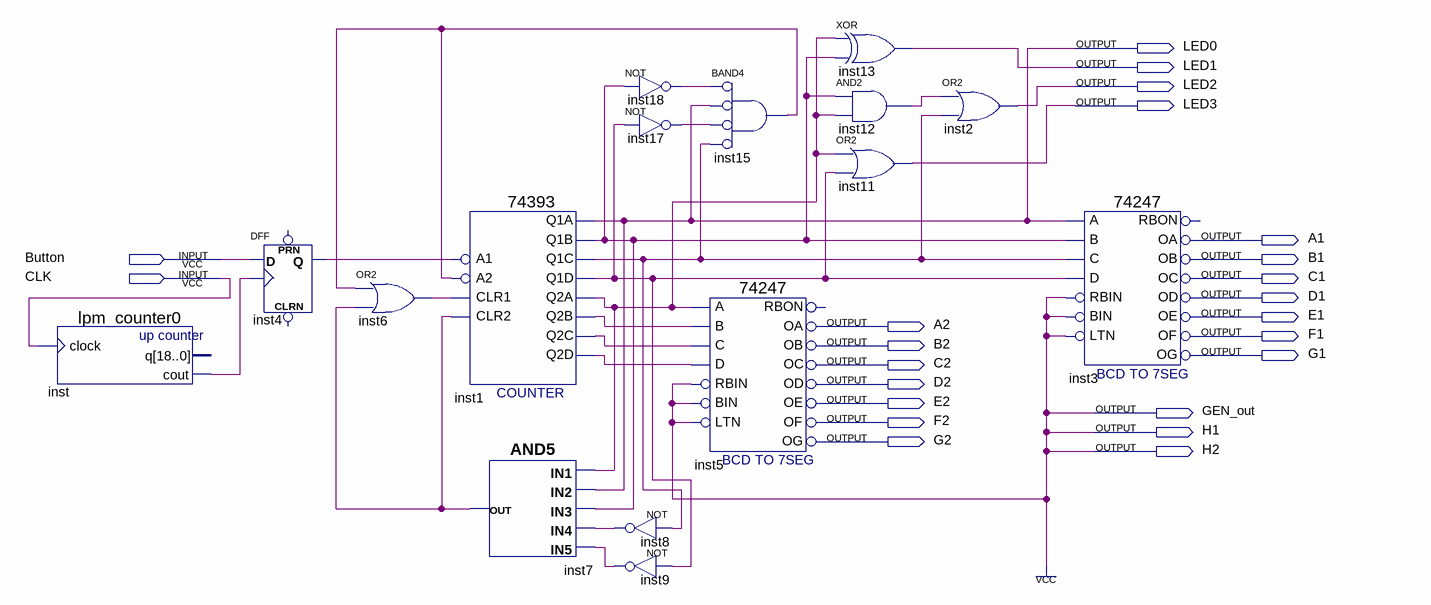
[diagram p0: schematic sheet]
// Quartus schematic lab6-2-1.bdf as structural Verilog: 16 symbols, 23 pins
module \lab6-2-1  (
  input  Button,
  input  CLK,
  output LED0,
  output LED1,
  output LED2,
  output LED3,
  output A1,
  output B1,
  output C1,
  output D1,
  output E1,
  output A2,
  output F1,
  output B2,
  output G1,
  output C2,
  output D2,
  output E2,
  output GEN_out,
  output F2,
  output H1,
  output G2,
  output H2
);

  wire inst1_q1b, inst1_q1c, inst1_q1d, inst1_q2a, inst1_q2b, inst1_q2c, inst1_q2d, inst4_q, inst6_out,
       inst7_out, inst8_out, inst9_out, inst12_out, inst15_out, inst17_out, inst18_out, inst_cout;

  lpm_counter0 inst (.clock(CLK), .cout(inst_cout));  // open: q
  DFF inst4 (.CLK(inst_cout), .D(Button), .Q(inst4_q));  // open: CLRN, PRN
  or inst6 (inst6_out, inst15_out, inst7_out);
  \74393  inst1 (
    .A1(inst4_q), .CLR1(inst6_out), .A2(inst15_out), .CLR2(inst7_out), .Q2D(inst1_q2d), .Q2C(inst1_q2c),
    .Q2B(inst1_q2b), .Q1C(inst1_q1c), .Q1D(inst1_q1d), .Q2A(inst1_q2a), .Q1A(LED0), .Q1B(inst1_q1b));
  and inst7 (inst7_out, inst1_q2a, LED0, inst1_q1b, inst8_out, inst9_out);
  not inst18 (inst18_out, inst1_q1b);
  not inst17 (inst17_out, inst1_q1d);
  not inst8 (inst8_out, inst1_q1c);
  not inst9 (inst9_out, inst1_q1d);
  and inst15 (inst15_out, ~inst18_out, ~LED0, ~inst17_out, ~inst1_q1c);  // BAND4
  \74247  inst5 (
    .LTN(1'b1), .BIN(1'b1), .A(inst1_q2a), .B(inst1_q2b), .RBIN(1'b1), .C(inst1_q2c), .D(inst1_q2d), .OF(F2),
    .OC(C2), .OD(D2), .OE(E2), .OA(A2), .OB(B2), .OG(G2));  // open: RBON
  xor inst13 (LED1, inst1_q2a, inst1_q1b);
  and inst12 (inst12_out, inst1_q1b, inst1_q2a);
  or inst11 (LED3, inst1_q2a, inst1_q1d);
  or inst2 (LED2, inst12_out, inst1_q1c);
  \74247  inst3 (
    .LTN(1'b1), .BIN(1'b1), .A(LED0), .B(inst1_q1b), .RBIN(1'b1), .C(inst1_q1c), .D(inst1_q1d), .OF(F1),
    .OC(C1), .OD(D1), .OE(E1), .OA(A1), .OB(B1), .OG(G1));  // open: RBON

  assign GEN_out = 1'b1;
  assign H1 = 1'b1;
  assign H2 = 1'b1;
endmodule
